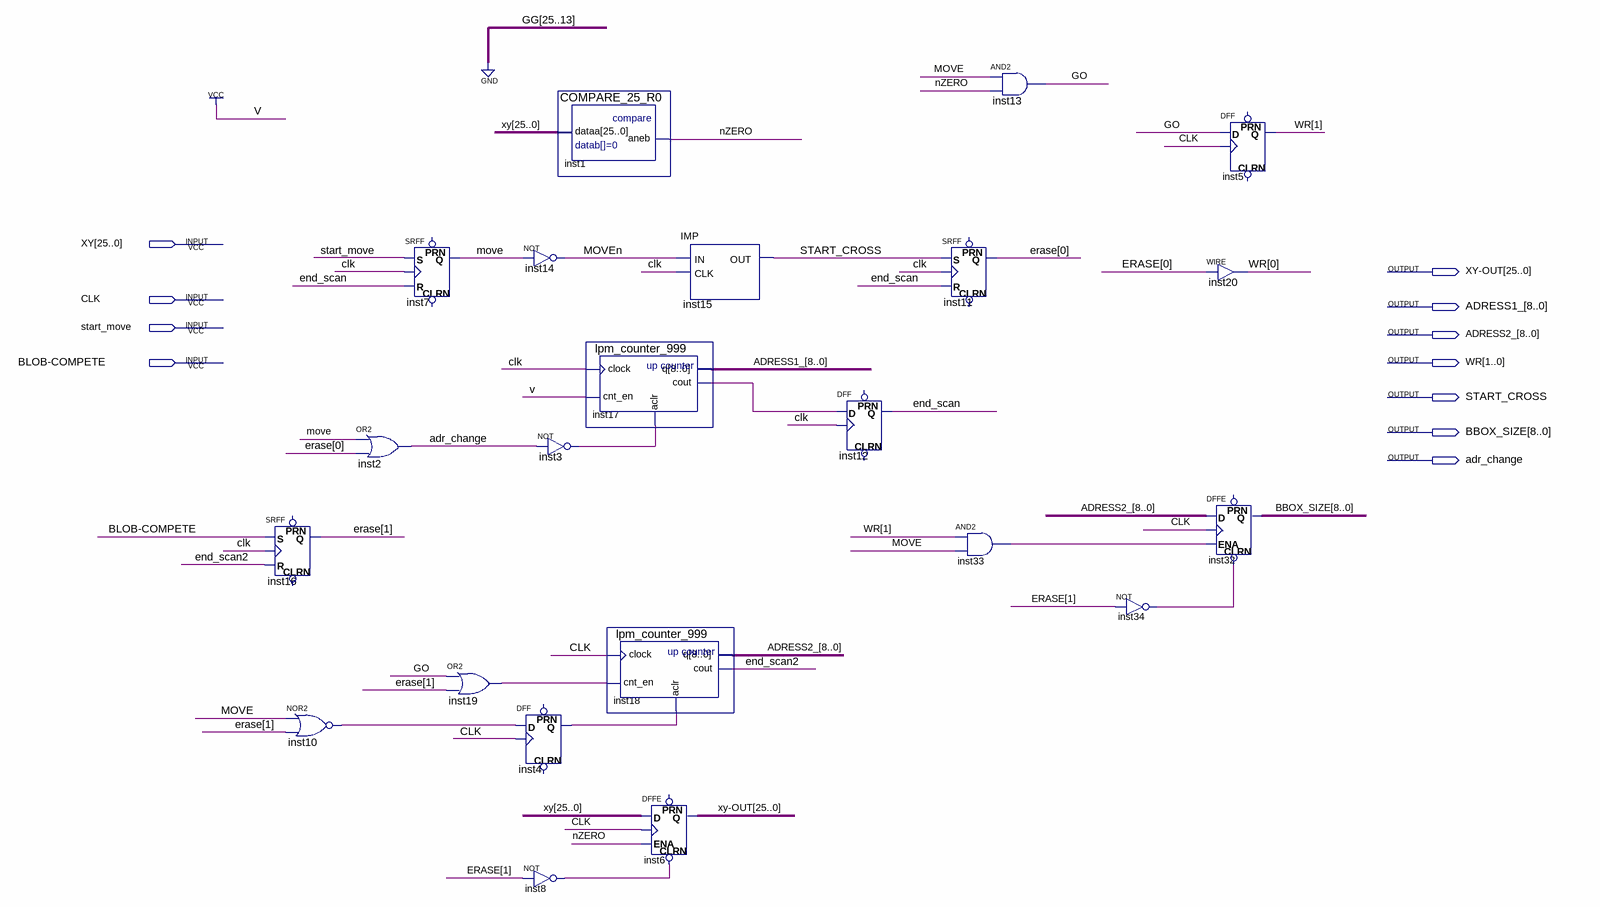
[diagram p0: schematic sheet]
// Quartus schematic TABLE_FILTER_h.bdf as structural Verilog: 22 symbols, 11 pins
module TABLE_FILTER_h (
  input  [25:0] XY,
  input  CLK,
  input  start_move,
  input  \BLOB-COMPETE ,
  output [25:0] \XY-OUT ,
  output [8:0] ADRESS1_,
  output [8:0] ADRESS2_,
  output [1:0] WR,
  output START_CROSS,
  output [8:0] BBOX_SIZE,
  output adr_change
);

  wire end_scan, end_scan2, GO, inst3_out, inst4_q, inst8_out, inst10_out, inst17_cout, inst19_out,
       inst33_out, inst34_out, move, MOVEn, nZERO;
  wire [1:0] ERASE;

  SRFF inst16 (.S(\BLOB-COMPETE ), .R(end_scan2), .CLK(CLK), .Q(ERASE[1]));  // open: PRN, CLRN
  nor inst10 (inst10_out, move, ERASE[1]);
  or inst2 (adr_change, move, ERASE[0]);
  SRFF inst7 (.S(start_move), .R(end_scan), .CLK(CLK), .Q(move));  // open: PRN, CLRN
  or inst19 (inst19_out, GO, ERASE[1]);
  COMPARE_25_R0 inst1 (.dataa(XY), .aneb(nZERO));
  not inst14 (MOVEn, move);
  not inst3 (inst3_out, adr_change);
  DFF inst4 (.CLK(CLK), .D(inst10_out), .Q(inst4_q));  // open: CLRN, PRN
  not inst8 (inst8_out, ERASE[1]);
  lpm_counter_999 inst17 (.clock(CLK), .cnt_en(1'b1), .aclr(inst3_out), .cout(inst17_cout), .q(ADRESS1_));
  lpm_counter_999 inst18 (.clock(CLK), .cnt_en(inst19_out), .aclr(inst4_q), .cout(end_scan2), .q(ADRESS2_));
  DFFE inst6[25:0] (.CLRN(inst8_out), .D(XY), .CLK(CLK), .ENA(nZERO), .Q(\XY-OUT ));  // open: PRN
  IMP inst15 (.IN(MOVEn), .CLK(CLK), .OUT(START_CROSS));
  DFF inst12 (.CLK(CLK), .D(inst17_cout), .Q(end_scan));  // open: CLRN, PRN
  SRFF inst11 (.S(START_CROSS), .R(end_scan), .CLK(CLK), .Q(ERASE[0]));  // open: PRN, CLRN
  and inst13 (GO, move, nZERO);
  and inst33 (inst33_out, WR[1], move);
  not inst34 (inst34_out, ERASE[1]);
  DFF inst5 (.CLK(CLK), .D(GO), .Q(WR[1]));  // open: CLRN, PRN
  assign WR[0] = ERASE[0];  // WIRE inst20
  DFFE inst32[8:0] (.CLRN(inst34_out), .D(ADRESS2_), .CLK(CLK), .ENA(inst33_out), .Q(BBOX_SIZE));  // open: PRN
endmodule
